# EAGLE design PillEndo-Proto_PWR (EAGLE 6.5.0)
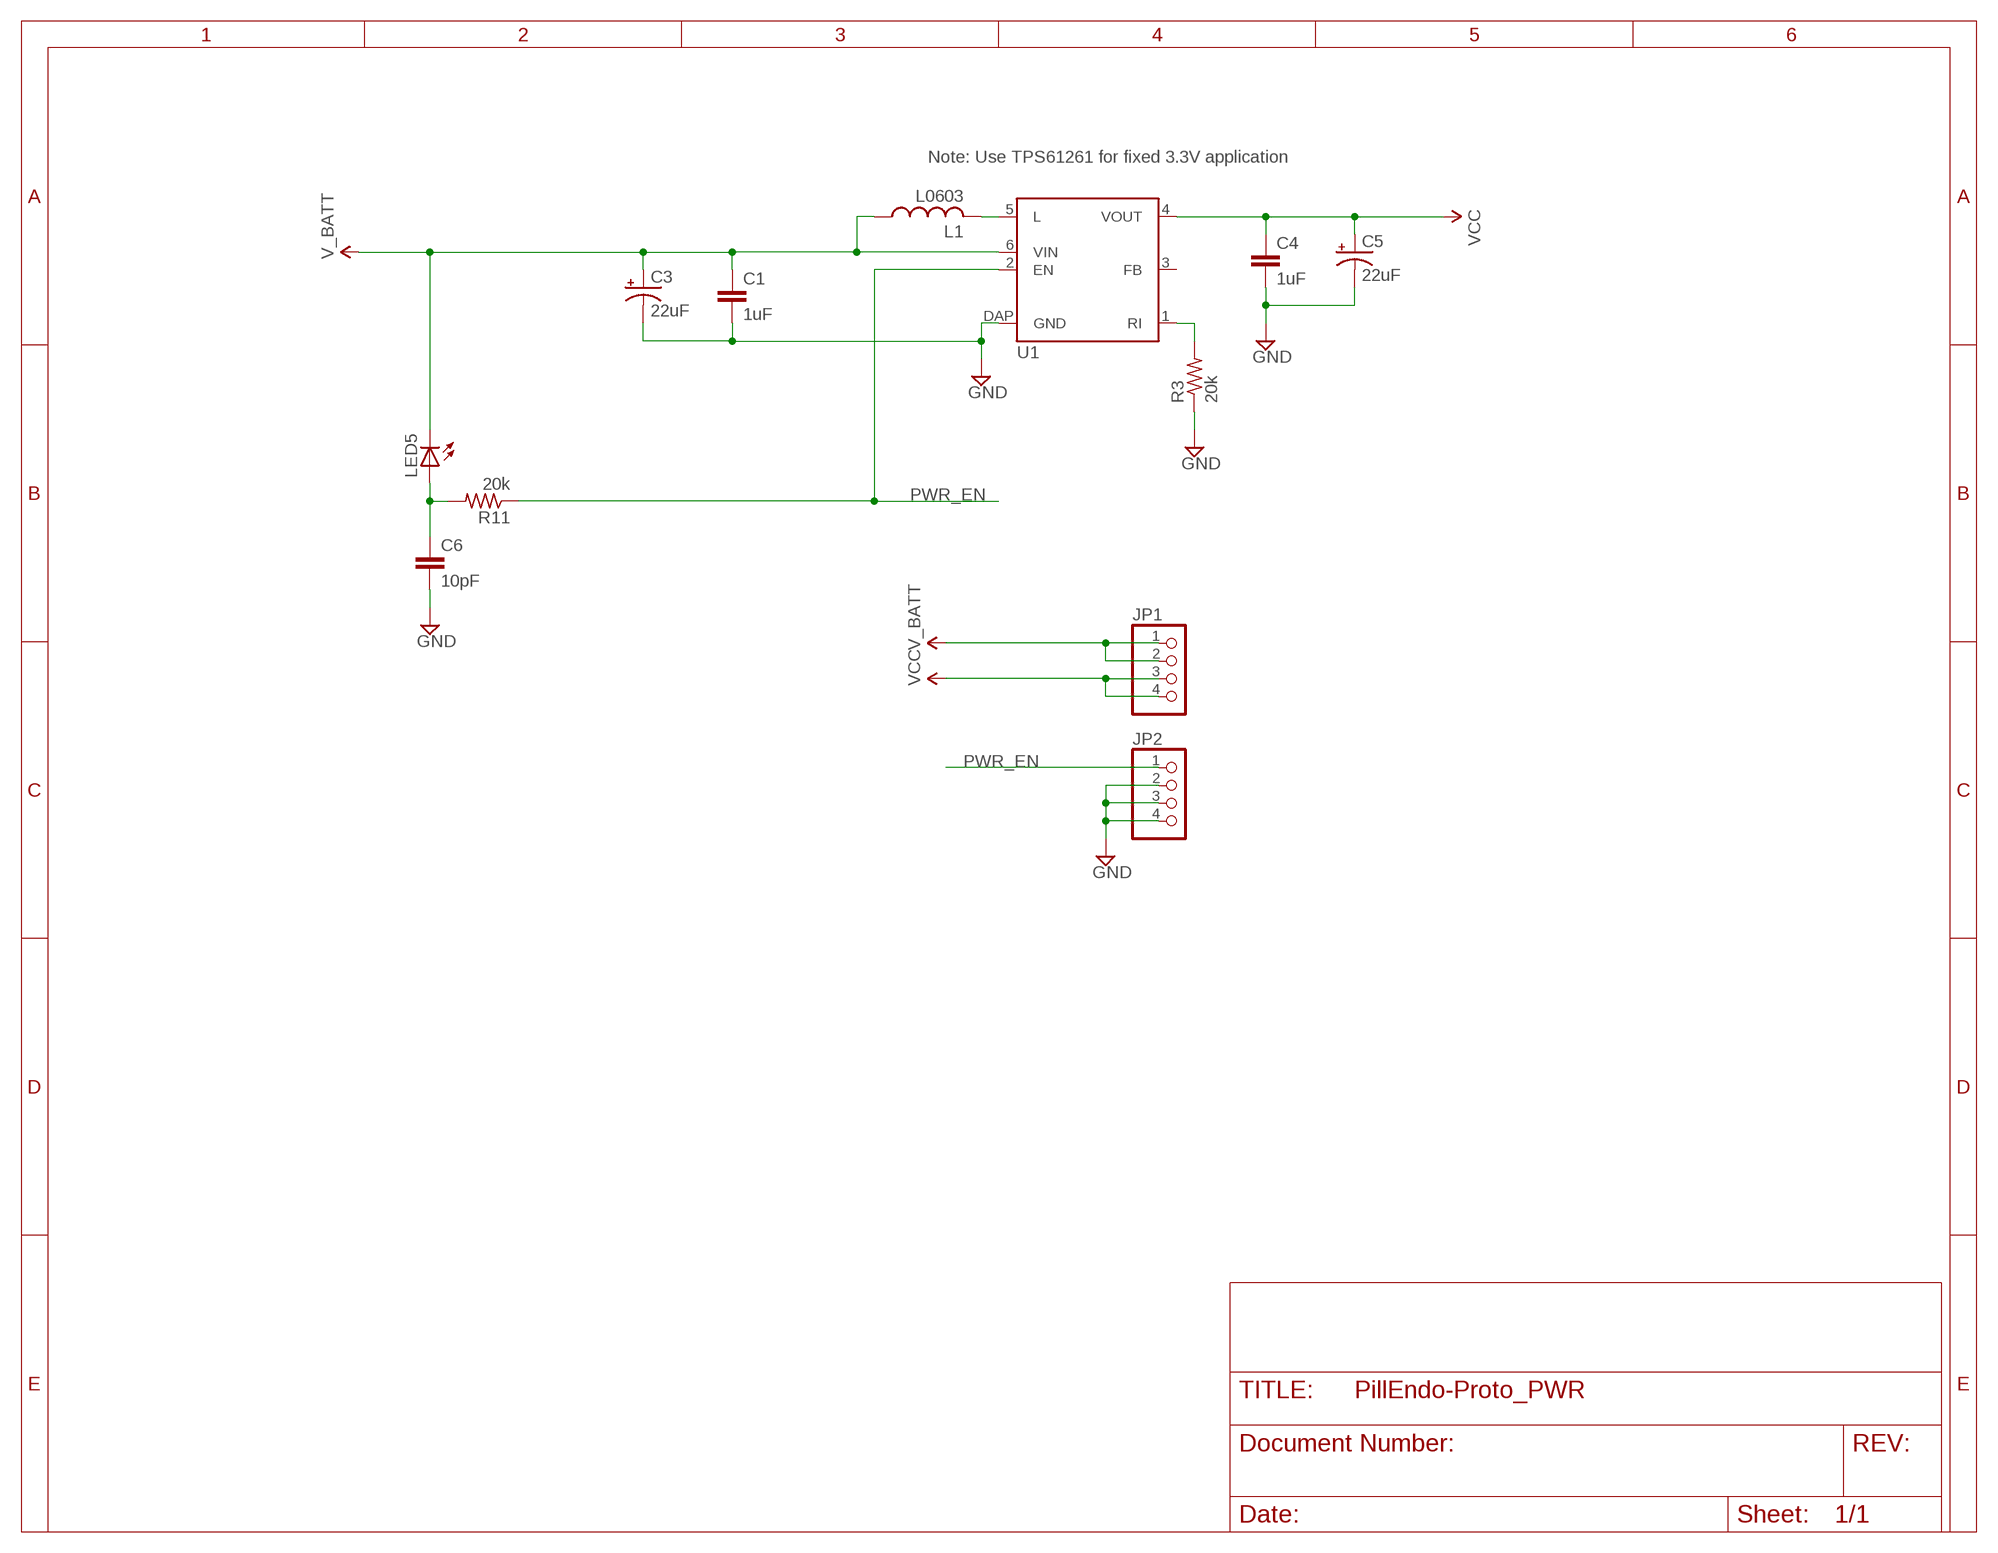
[diagram p0: schematic, sheet 1]

## Parts
C1  1uF  C-EUC0603  [C0603]
C3  22uF  CPOL-USCT3216  [CT3216]
C4  1uF  C-EUC0603  [C0603]
C5  22uF  CPOL-USCT3216  [CT3216]
C6  10pF  C-EUC0603  [C0603]
JP1  PINHD-1X4  [1X04]
JP2  PINHD-1X4  [1X04]
L1  L0603  [L0603]
LED5  LEDCHIP-LED0603  [CHIP-LED0603]
R3  20k  R-US_R0603  [R0603]
R11  20k  R-US_R0603  [R0603]
U1  TPS61260  [S-PWSON-N6]

## Nets
GND: C1.2 C3.- C4.2 C5.- JP2.2 JP2.3 JP2.4 R3.1 U1.DAP(GND)
N$9: L1.2 U1.5(L)
N$10: R3.2 U1.1(RI)
N$11: C6.1 LED5.A R11.2
PWR_EN: JP2.1 R11.1 U1.2(EN)
V_BATT: C1.1 C3.+ JP1.1 JP1.2 L1.1 LED5.C U1.6(VIN)
VCC: C4.1 C5.+ JP1.3 JP1.4 U1.4(VOUT)
Unconnected: C6.2 U1.3(FB)

## Notes on the sheet
- Note: Use TPS61261 for fixed 3.3V application

## Library data of the parts
C1 C4 C6 = rcl:C-EU: CAPACITOR, European symbol
C3 C5 = rcl:CPOL-US: POLARIZED CAPACITOR, American symbol
JP1 JP2 = pinhead:PINHD-1X4: PIN HEADER
L1 = MSSRP-Lib:L0603
LED5 = adafruit:LED: LED OSRAM: - CHIPLED LG R971, LG N971, LY N971, LG Q971, LY Q971, LO R971, LY R971 LH N974, LH R974 LS Q976, LO Q976, LY Q976 LO Q996 - Hyper CHIPLED LW Q18S LB Q993, LB Q99A, LB R99A - SideLED LS A670, LO A670, LY A670, LG A670, LP A670 LB A673, LV A673, LT A673, LW A673 LH A674 LY A675 LS A676, LA A676, LO A676, LY A676, LW A676 LS A679, LY A679, LG A679 - Hyper Micro SIDELED® LS Y876, LA Y876, LO Y876, LY Y876 LT Y87S - SmartLED LW L88C, LW L88S LB L89C, LB L89S, LG L890 LS L89K, LO L89K, LY L89K LS L896, LA L896, LO L896, LY L896 - TOPLED LS T670, LO T670, LY T670, LG T670, LP T670 LSG T670, LSP T670, LSY T670, LOP T670, LYG T670 LG T671, LOG T671, LSG T671 LB T673, LV T673, LT T673, LW T673 LH T674 LS T676, LA T676, LO T676, LY T676, LB T676, LH T676, LSB T676, LW T676 LB T67C, LV T67C, LT T67C, LS T67K, LO T67K, LY T67K, LW E67C LS E67B, LA E67B, LO E67B, LY E67B, LB E67C, LV E67C, LT E67C LW T67C LS T679, LY T679, LG T679 LS T770, LO T770, LY T770, LG T770, LP T770 LB T773, LV T773, LT T773, LW T773 LH T774 LS E675, LA E675, LY E675, LS T675 LS T776, LA T776, LO T776, LY T776, LB T776 LHGB T686 LT T68C, LB T68C - Hyper Mini TOPLED® LB M676 - Mini TOPLED Santana® LG M470 LS M47K, LO M47K, LY M47K Source: http://www.osram.convergy.de/
R3 R11 = rcl:R-US_: RESISTOR, American symbol
U1 = MSSRP-Lib:TPS61260

## Board
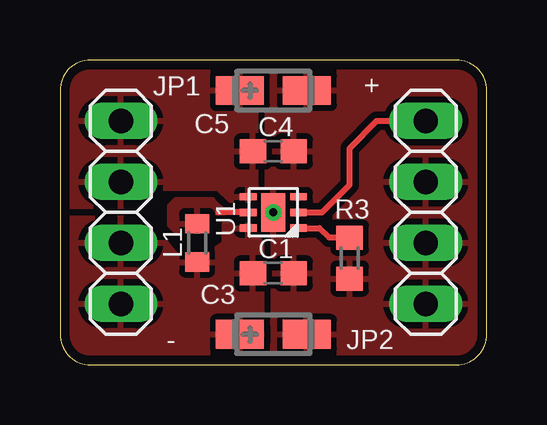
[diagram p1: board, top side]
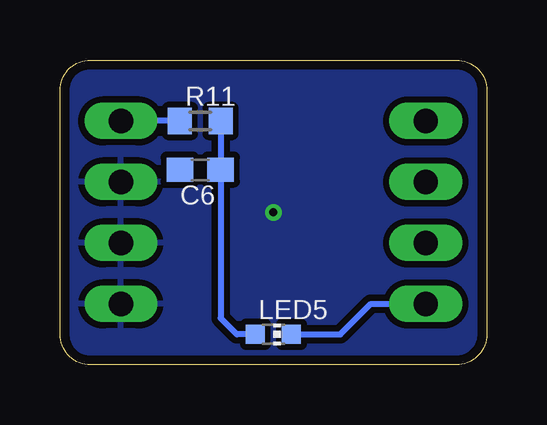
[diagram p2: board, bottom side, seen from below]

Size 17.78 x 12.7 mm. Coordinates in mm from the lower left corner, seen from the top.
Outline: 1.27,0 16.51,0 arc90 17.78,1.27 17.78,11.43 arc90 16.51,12.7 1.27,12.7 arc90 0,11.43 0,1.27 arc90 1.27,0
Copper layers (1*16): Top 0.0356mm / dielectric 1.5011mm / Bottom 0.0356mm
Design rules "LaenPCBOrder": minimum track width 6mil, minimum drill 13mil, track to track 6mil, track to pad 6mil, pad to pad 6mil, via to via 6mil, smd to smd 6mil, copper to edge 15mil, drill to drill 6mil, minimum pad ring 7mil, minimum via ring 7mil, stop-mask expansion 3mil, vias tented up to drill 0mil, thermal gap 10mil

### Footprints (pad centres in the part's own frame; a part is rotated, then mirrored left to right if it is on the bottom)
C0603 = smd 1.1 x 1: 1 -0.85,0; 2 0.85,0
CT3216 = smd 2 x 1.2: + -1.4,0; - 1.4,0
1X04 = drill 1.016 long: 1 -3.81,0; 2 -1.27,0; 3 1.27,0; 4 3.81,0
L0603 = smd 0.8 x 1: 1 -0.8,0; 2 0.8,0
CHIP-LED0603 = smd 0.8 x 0.8: A 0,-0.75; C 0,0.75
R0603 = smd 1 x 1.1: 1 -0.85,0; 2 0.85,0
S-PWSON-N6 = smd 0.3 x 0.7: 1 -0.65,-1.05; 2 0,-1.05; 3 0.65,-1.05; 4 0.65,1.05; 5 0,1.05; 6 -0.65,1.05 | smd 1.6 x 1: DAP 0,0

### Placement (x,y rotation side)
C1  8.89,3.81 0 top
C3  8.89,1.27 0 top
C4  8.89,8.89 0 top
C5  8.89,11.43 0 top
C6  11.94,8.13 180 bottom
JP1  2.54,6.35 90 top
JP2  15.24,6.35 270 top
L1  5.71,5.08 90 top
LED5  8.89,1.27 270 bottom
R3  12.06,4.45 90 top
R11  11.94,10.16 0 bottom
U1  8.89,6.35 90 top

### Tracks (layer width: path | path; a pad name or v marks a point on that pad's centre or on a via)
GND  (via drill 0.33)
  other vias: 8.89,6.35
  pour Bottom (isolate 0.254, rank 6): 0,0 17.78,0 17.78,12.7 0,12.7
  pour Top (isolate 0.254, rank 6): 0,0 17.78,0 17.78,12.7 0,12.7
N$9
  Top 0.254: U1.5 6.6,6.35
  pour Top (isolate 0.254): 6.86,6.35 6.35,6.86 4.83,6.86 4.57,6.6 4.57,5.84 4.83,5.59 6.1,5.59 6.1,6.35
N$10
  Top 0.254: U1.1 10.81,5.7 11.21,5.29 R3.2
N$11
  Bottom 0.254: R11.2 C6.1 11.09,1.94 10.41,1.27 LED5.A
PWR_EN
  Top 0.254: U1.2 10.92,6.35 12.06,7.49 12.06,9.02 13.21,10.16 JP2.1
  Bottom 0.254: R11.1 JP2.1
V_BATT
  Bottom 0.254: LED5.C 6.1,1.27 4.83,2.54 JP1.1
  pour Top (isolate 0.254): 0,6.1 3.56,6.1 4.83,4.57 6.1,4.57 6.86,5.08 6.86,5.84 8.13,5.84 8.13,5.33 8.38,5.08 8.38,0 0,0
VCC
  pour Top (isolate 0.254): 0,6.6 0,12.7 8.13,12.7 8.13,7.11 7.87,6.86 7.11,6.86 6.6,7.37 4.32,7.37 3.56,6.6

### Text on the board
tPlace: + | -